# EAGLE design mic-preamp-stereo7 (EAGLE 6.2)
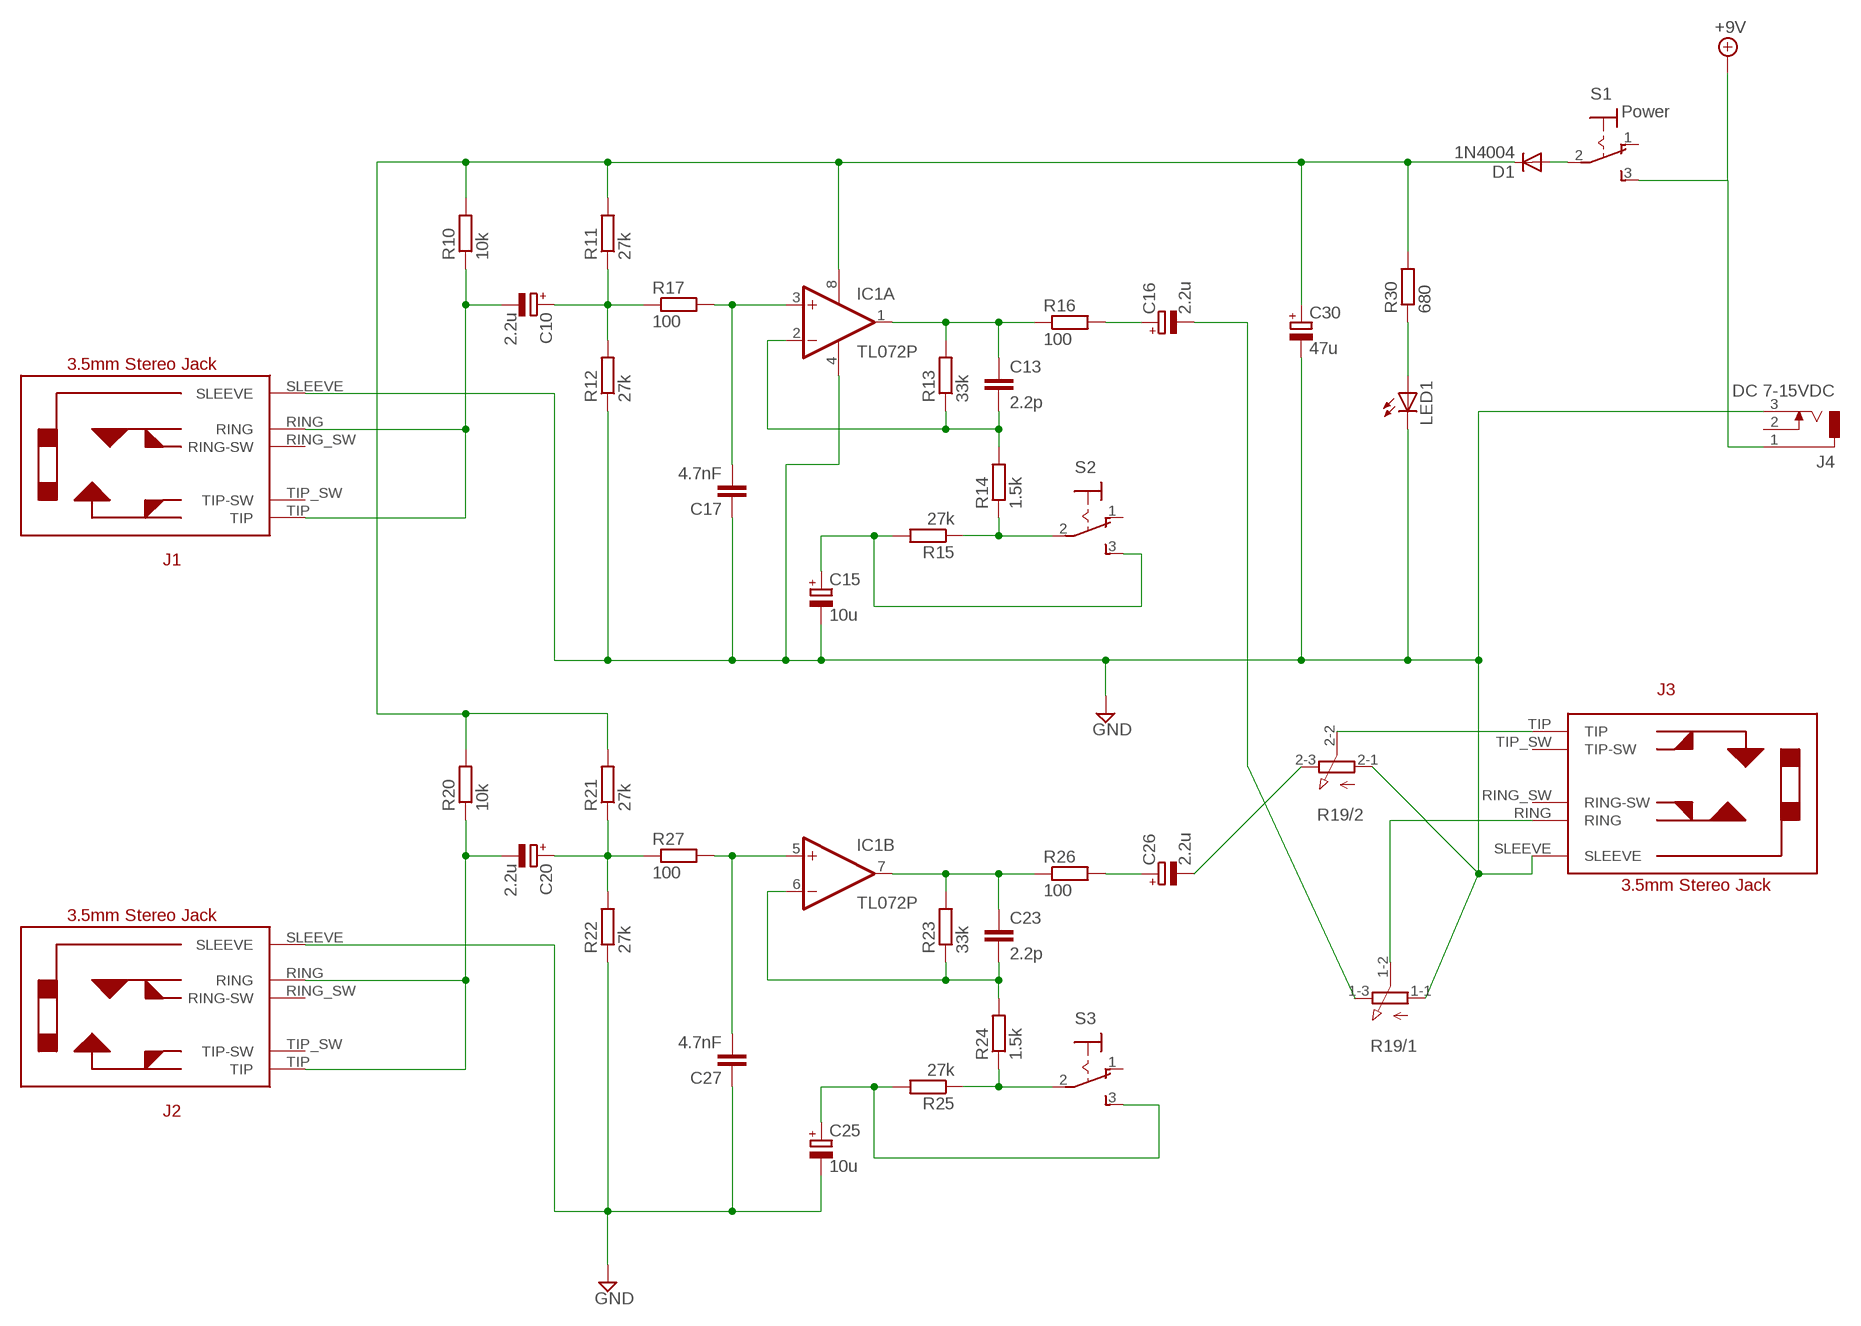
[diagram p0: schematic, sheet 1]

## Parts
C10  2.2u  CPOL-EUE2-5  [E2-5]
C13  2.2p  C-EU025-024X044  [C025-024X044]
C15  10u  CPOL-EUE2-5  [E2-5]
C16  2.2u  CPOL-EUE2-5  [E2-5]
C17  4.7nF  C-EU025-024X044  [C025-024X044]
C20  2.2u  CPOL-EUE2-5  [E2-5]
C23  2.2p  C-EU025-024X044  [C025-024X044]
C25  10u  CPOL-EUE2-5  [E2-5]
C26  2.2u  CPOL-EUE2-5  [E2-5]
C27  4.7nF  C-EU025-024X044  [C025-024X044]
C30  47u  CPOL-EUE2-5  [E2-5]
D1  1N4004  [DO41-10]
IC1  TL072P  [DIL08]
J1  PICAXE_STEREOJACKSOCKET  [PICAXE_STEREOJACKSOCKET]
J2  PICAXE_STEREOJACKSOCKET  [PICAXE_STEREOJACKSOCKET]
J3  Stereo Out  PICAXE_STEREOJACKSOCKET  [PICAXE_STEREOJACKSOCKET]
J4  DC 7-15VDC  DCJ0202  [DCJ0202]
LED1  LED5MM  [LED5MM]
R10  10k  R-EU_0207/5V  [0207/5V]
R11  27k  R-EU_0207/5V  [0207/5V]
R12  27k  R-EU_0207/5V  [0207/5V]
R13  33k  R-EU_0207/5V  [0207/5V]
R14  1.5k  R-EU_0207/5V  [0207/5V]
R15  27k  R-EU_0207/5V  [0207/5V]
R16  100  R-EU_0207/5V  [0207/5V]
R17  100  R-EU_0207/5V  [0207/5V]
R19  3RP/1610G  [3RP/1610G]
R20  10k  R-EU_0207/5V  [0207/5V]
R21  27k  R-EU_0207/5V  [0207/5V]
R22  27k  R-EU_0207/5V  [0207/5V]
R23  33k  R-EU_0207/5V  [0207/5V]
R24  1.5k  R-EU_0207/5V  [0207/5V]
R25  27k  R-EU_0207/5V  [0207/5V]
R26  100  R-EU_0207/5V  [0207/5V]
R27  100  R-EU_0207/5V  [0207/5V]
R30  680  R-EU_0207/5V  [0207/5V]
S1  Power  M9040P  [M9040P]
S2  M9040P  [M9040P]
S3  M9040P  [M9040P]

## Nets
+9V: J4.1 S1.3(S)
GND [Ground]: C15.- C17.1 C25.- C27.1 C30.- IC1.4(P:V-) J1.SLEEVE J2.SLEEVE J3.SLEEVE J4.3 LED1.K(C) R12.1 R19.1-1(/1:A) R19.2-1(/2:A) R22.1
N$1: C10.+ R11.1 R12.2 R17.1
N$2: C13.1 IC1.1(A:OUT) R13.2 R16.1
N$3: C13.2 IC1.2(A:-IN) R13.1 R14.2
N$4: C30.+ D1.C IC1.8(P:V+) R10.2 R11.2 R20.2 R21.2 R30.2
N$5: R14.1 R15.1 S2.2(P)
N$6: C16.+ R16.2
N$7: C10.- J1.RING J1.TIP R10.1
N$8: D1.A S1.2(P)
N$9: C15.+ R15.2 S2.3(S)
N$10: C16.- R19.1-3(/1:E)
N$11: LED1.A R30.1
N$12: C20.+ R21.1 R22.2 R27.1
N$13: C26.- R19.2-3(/2:E)
N$16: C23.1 IC1.7(B:OUT) R23.2 R26.1
N$17: C23.2 IC1.6(B:-IN) R23.1 R24.2
N$18: J3.TIP R19.2-2(/2:S)
N$19: R24.1 R25.1 S3.2(P)
N$20: C26.+ R26.2
N$21: C20.- J2.RING J2.TIP R20.1
N$22: C25.+ R25.2 S3.3(S)
N$23: J3.RING R19.1-2(/1:S)
N$24: C17.2 IC1.3(A:+IN) R17.2
N$27: C27.2 IC1.5(B:+IN) R27.2
Unconnected: J1.RING_SW(RING-SW) J1.TIP_SW(TIP-SW) J2.RING_SW(RING-SW) J2.TIP_SW(TIP-SW) J3.RING_SW(RING-SW) J3.TIP_SW(TIP-SW) J4.2 S1.1(O) S2.1(O) S3.1(O)

## Library data of the parts
C10 C15 C16 C20 C25 C26 C30 = rcl:CPOL-EU: POLARIZED CAPACITOR, European symbol
C13 C17 C23 C27 = rcl:C-EU: CAPACITOR, European symbol
D1 = diode:1N4004: DIODE general purpose rectifier, 1 A
IC1 = linear:TL072: OP AMP
J1-J3 = PICAXE_StereoJackSocket:PICAXE_STEREOJACKSOCKET
J4 = con-jack:DCJ0202: DC POWER JACK Source: DCJ0202.pdf; OC_FARNELL: unknown; OC_NEWARK: unknown
LED1 = led:LED: LED OSRAM: - CHIPLED LG R971, LG N971, LY N971, LG Q971, LY Q971, LO R971, LY R971 LH N974, LH R974 LS Q976, LO Q976, LY Q976 LO Q996 - Hyper CHIPLED LW Q18S LB Q993, LB Q99A, LB R99A - SideLED LS A670, LO A670, LY A670, LG A670, LP A670 LB A673, LV A673, LT A673, LW A673 LH A674 LY A675 LS A676, LA A676, LO A676, LY A676, LW A676 LS A679, LY A679, LG A679 - Hyper Micro SIDELED® LS Y876, LA Y876, LO Y876, LY Y876 LT Y87S - SmartLED LW L88C, LW L88S LB L89C, LB L89S, LG L890 LS L89K, LO L89K, LY L89K LS L896, LA L896, LO L896, LY L896 - TOPLED LS T670, LO T670, LY T670, LG T670, LP T670 LSG T670, LSP T670, LSY T670, LOP T670, LYG T670 LG T671, LOG T671, LSG T671 LB T673, LV T673, LT T673, LW T673 LH T674 LS T676, LA T676, LO T676, LY T676, LB T676, LH T676, LSB T676, LW T676 LB T67C, LV T67C, LT T67C, LS T67K, LO T67K, LY T67K, LW E67C LS E67B, LA E67B, LO E67B, LY E67B, LB E67C, LV E67C, LT E67C LW T67C LS T679, LY T679, LG T679 LS T770, LO T770, LY T770, LG T770, LP T770 LB T773, LV T773, LT T773, LW T773 LH T774 LS E675, LA E675, LY E675, LS T675 LS T776, LA T776, LO T776, LY T776, LB T776 LHGB T686 LT T68C, LB T68C - Hyper Mini TOPLED® LB M676 - Mini TOPLED Santana® LG M470 LS M47K, LO M47K, LY M47K Source: http://www.osram.convergy.de LUXEON: - LUMILED® LXK2-PW12-R00, LXK2-PW12-S00, LXK2-PW14-U00, LXK2-PW14-V00 LXK2-PM12-R00, LXK2-PM12-S00, LXK2-PM14-U00 LXK2-PE12-Q00, LXK2-PE12-R00, LXK2-PE12-S00, LXK2-PE14-T00, LXK2-PE14-U00 LXK2-PB12-K00, LXK2-PB12-L00, LXK2-PB12-M00, LXK2-PB14-N00, LXK2-PB14-P00, LXK2-PB14-Q00 LXK2-PR12-L00, LXK2-PR12-M00, LXK2-PR14-Q00, LXK2-PR14-R00 LXK2-PD12-Q00, LXK2-PD12-R00, LXK2-PD12-S00 LXK2-PH12-R00, LXK2-PH12-S00 LXK2-PL12-P00, LXK2-PL12-Q00, LXK2-PL12-R00 Source: www.luxeon.com KINGBRIGHT: KA-3528ASYC Source: www.kingbright.com
R10-R16 R20-R26 R30 = rcl:R-EU_: RESISTOR, European symbol
R17 R27 = resistor:R-EU_: RESISTOR, European symbol
R19 = pot:3RP/1610G: 16mm Potentiometer two level Source: http://www.alphapotentiometers.net/html/16mm_pot_2.html
S1-S3 = switch:M9040P: TOGGLE SWITCH Marquardt

## Net classes
0 default: width 0.381 mm
1 Ground: width 0.305 mm, clearance 0.229 mm

## Board
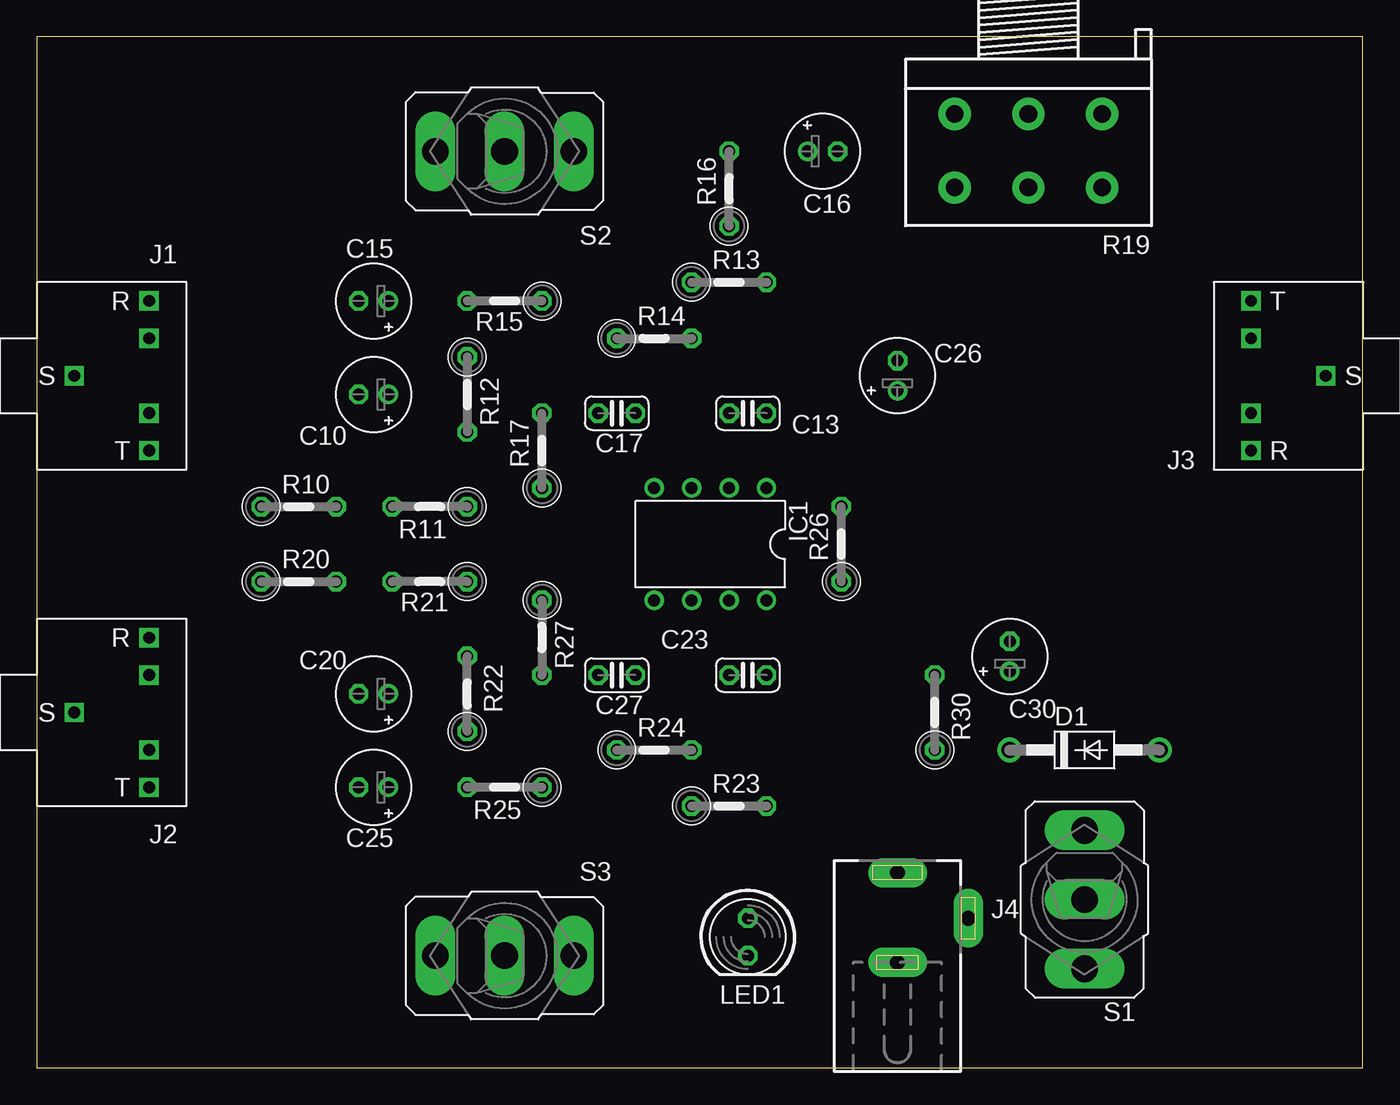
[diagram p1: board, top side]
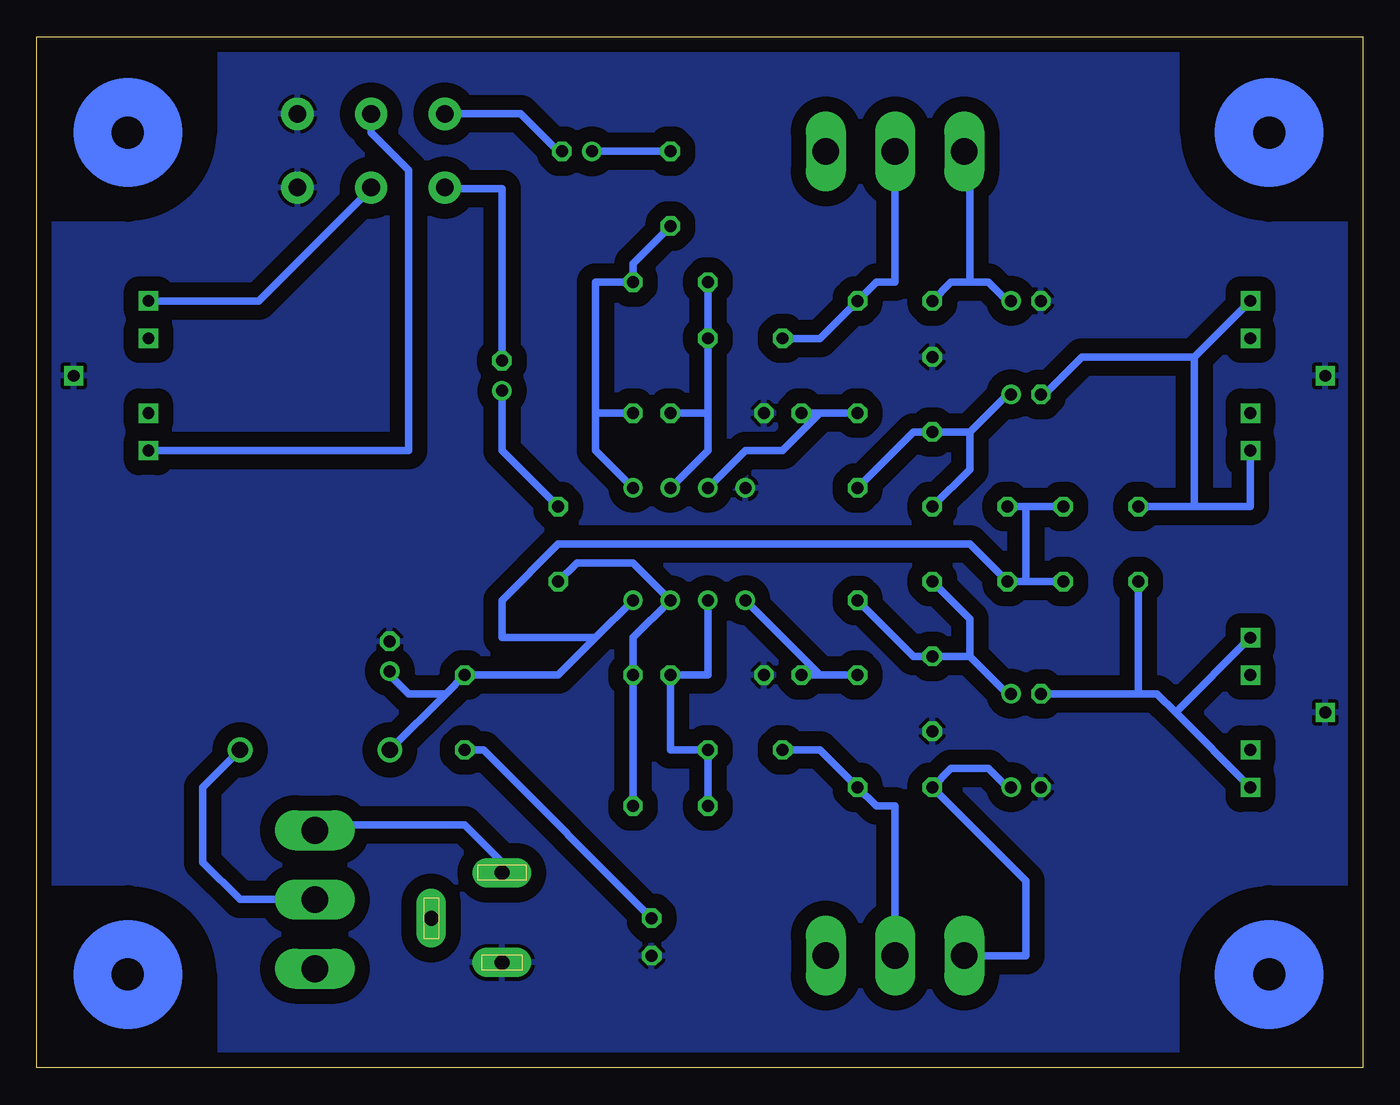
[diagram p2: board, bottom side, seen from below]

Size 90 x 70 mm. Coordinates in mm from the lower left corner, seen from the top.
Outline: 0,0 90,0 90,70 0,70 0,0
Copper layers 16: Bottom 0.035mm
Design rules: minimum track width 20mil, minimum drill 0.3mm, track to track 10mil, track to pad 10mil, pad to pad 10mil, via to via 10mil, smd to smd 10mil, copper to edge 40mil, drill to drill 8mil, minimum pad ring 10mil, minimum via ring 8mil, stop-mask expansion 8mil, vias tented up to drill 0mil, thermal gap 10mil
bRestrict: area 79,-2.5 to 92.7,11.2; area 82,61.7 to 85.6,65.3; area 4.6,61.7 to 8.1,65.3; area 4.6,4.6 to 8.1,8.1; area 79,58.7 to 92.7,72.4; area -2.5,58.7 to 11.2,72.4; area -2.5,-2.5 to 11.2,11.2; area 82,4.6 to 85.6,8.1

### Footprints (pad centres in the part's own frame; a part is rotated, then mirrored left to right if it is on the bottom)
E2-5 = drill 0.813 pad 1.27: + -1.016,0 | drill 0.813 pad 1.27 octagon: - 1.016,0
C025-024X044 = drill 0.813 octagon: 1 -1.27,0; 2 1.27,0
DO41-10 = drill 1.118: A 5.08,0; C -5.08,0
DIL08 = drill 0.813 pad 1.27: 1 -3.81,-3.81; 2 -1.27,-3.81; 3 1.27,-3.81; 4 3.81,-3.81; 5 3.81,3.81; 6 1.27,3.81; 7 -1.27,3.81; 8 -3.81,3.81
PICAXE_STEREOJACKSOCKET = drill 0.8 square: RING -5.08,-5.08; RING_SW -5.08,-2.54; SLEEVE 0,0; TIP -5.08,5.08; TIP_SW -5.08,2.54
DCJ0202 = drill 1 pad 2 long: 1 0,3.1; 2 4.8,0; 3 0,-3
LED5MM = drill 0.813 octagon: A -1.27,0; K 1.27,0
0207/5V = drill 0.813 octagon: 1 -2.54,0; 2 2.54,0
3RP/1610G = drill 1.2 pad 2.184: 1-1 -5,0; 1-2 0,0; 1-3 5,0; 2-1 -5,5; 2-2 0,5; 2-3 5,5
M9040P = drill 1.803 long: 1 0,4.699; 2 0,0; 3 0,-4.699

### Placement (x,y rotation side)
C10  22.86,45.72 180 top
C13  48.26,44.45 180 top
C15  22.86,52.07 180 top
C16  53.34,62.23 0 top
C17  39.37,44.45 180 top
C20  22.86,25.4 180 top
C23  48.26,26.67 180 top
C25  22.86,19.05 180 top
C26  58.42,46.99 90 top
C27  39.37,26.67 180 top
C30  66.04,27.94 90 top
D1  71.12,21.59 0 top
IC1  45.72,35.56 180 top
J1  2.54,46.99 180 top
J2  2.54,24.13 180 top
J3  87.5,46.99 0 top
J4  58.42,10.16 0 top
LED1  48.26,8.89 270 top
R10  17.78,38.1 0 top
R11  26.67,38.1 180 top
R12  29.21,45.72 270 top
R13  46.99,53.34 0 top
R14  41.91,49.53 0 top
R15  31.75,52.07 180 top
R16  46.99,59.69 90 top
R17  34.29,41.91 90 top
R19  67.31,64.77 180 top
R20  17.78,33.02 0 top
R21  26.67,33.02 180 top
R22  29.21,25.4 90 top
R23  46.99,17.78 0 top
R24  41.91,21.59 0 top
R25  31.75,19.05 180 top
R26  54.61,35.56 90 top
R27  34.29,29.21 270 top
R30  60.96,24.13 90 top
S1  71.12,11.43 180 top
S2  31.75,62.23 270 top
S3  31.75,7.62 270 top

### Tracks (layer width: path | path; a pad name or v marks a point on that pad's centre or on a via)
+9V
  Bottom 0.508: J4.1 58.42,13.97 60.96,16.51 71.12,16.51 S1.3
GND
  pour Bottom (isolate 1.016): 0,69.85 90.17,69.85 90.17,0 0,0
N$1
  Bottom 0.508: 26.67,43.18 24.13,45.72 C10.+ | 26.67,43.18 R12.2 30.48,43.18 R17.1 | R11.1 26.67,40.64 26.67,43.18
N$2
  Bottom 0.508: IC1.1 52.07,41.91 52.07,44.45 | C13.1 52.07,44.45 | R16.1 49.53,54.61 R13.2 52.07,53.34 52.07,44.45
N$3
  Bottom 0.508: IC1.2 44.45,41.91 44.45,44.45 | C13.2 44.45,44.45 | 44.45,44.45 R14.2 R13.1
N$4
  Bottom 0.508: 22.86,33.02 R21.2 26.67,35.56 54.61,35.56 58.42,31.75 58.42,29.21 52.07,29.21 | 22.86,33.02 R20.2 | R11.2 22.86,38.1 | 22.86,38.1 R10.2 | 22.86,38.1 22.86,33.02 | 52.07,29.21 54.61,26.67 R30.2 62.23,25.4 | 52.07,29.21 IC1.8 | 62.23,25.4 64.77,25.4 66.04,26.67 C30.+ | 62.23,25.4 D1.C
N$5
  Bottom 0.508: R14.1 36.83,49.53 R15.1 33.02,53.34 31.75,53.34 S2.2
N$6
  Bottom 0.508: C16.+ R16.2
N$7
  Bottom 0.508: J1.TIP 7.62,38.1 11.43,38.1 | R10.1 11.43,38.1 | 11.43,48.26 J1.RING | 11.43,38.1 11.43,48.26 | 11.43,48.26 19.05,48.26 21.59,45.72 C10.-
N$8
  Bottom 0.508: D1.A 78.74,19.05 78.74,13.97 76.2,11.43 S1.2
N$9
  Bottom 0.508: 26.67,53.34 27.94,53.34 R15.2 | 26.67,53.34 25.4,53.34 24.13,52.07 C15.+ | 26.67,53.34 26.67,62.23 S2.3
N$10
  Bottom 0.508: R19.1-3 57.15,64.77 54.61,62.23 C16.-
N$11
  Bottom 0.508: LED1.A 59.69,21.59 R30.1
N$12
  Bottom 0.508: 26.67,27.94 24.13,25.4 C20.+ | 26.67,27.94 R22.2 30.48,27.94 R27.1 | R21.1 26.67,30.48 26.67,27.94
N$13
  Bottom 0.508: C26.- 58.42,59.69 62.23,59.69 R19.2-3
N$16
  Bottom 0.508: R23.2 C23.1 49.53,29.21 IC1.7 49.53,34.29 53.34,34.29 R26.1
N$17
  Bottom 0.508: R23.1 R24.2 46.99,21.59 C23.2 44.45,26.67 IC1.6
N$18
  Bottom 0.508: 82.55,52.07 J3.TIP 74.93,52.07 67.31,59.69 R19.2-2
N$19
  Bottom 0.508: R24.1 36.83,21.59 R25.1 33.02,17.78 31.75,17.78 S3.2
N$20
  Bottom 0.508: R26.2 58.42,41.91 C26.+
N$21
  Bottom 0.508: 12.7,24.13 13.97,25.4 15.24,25.4 | 12.7,24.13 J2.TIP | C20.- 15.24,25.4 | 12.7,24.13 J2.RING | 15.24,25.4 R20.1
N$22
  Bottom 0.508: C25.+ 24.13,19.05 25.4,20.32 27.94,20.32 R25.2 22.86,12.7 22.86,7.62 S3.3
N$23
  Bottom 0.508: R19.1-2 67.31,63.5 64.77,60.96 64.77,41.91 J3.RING 82.55,41.91
N$24
  Bottom 0.508: C17.2 36.83,44.45 | 36.83,44.45 R17.2 | IC1.3 41.91,41.91 39.37,41.91 36.83,44.45
N$27
  Bottom 0.508: C27.2 36.83,26.67 | 36.83,26.67 R27.2 | 36.83,26.67 IC1.5
(copper drawn outside any net)
  shapes: Bottom circle x12

### Text on the board
tValues: Ⓛ | Gain | Ⓛ in | Ⓡ in | Stereo Out | (+) core | - | Ⓡ | + | Gain